# Altium schematic sheet MCU.SchDoc
size 389 x 250 mm; SheetNumber: 1; SheetTotal: 2
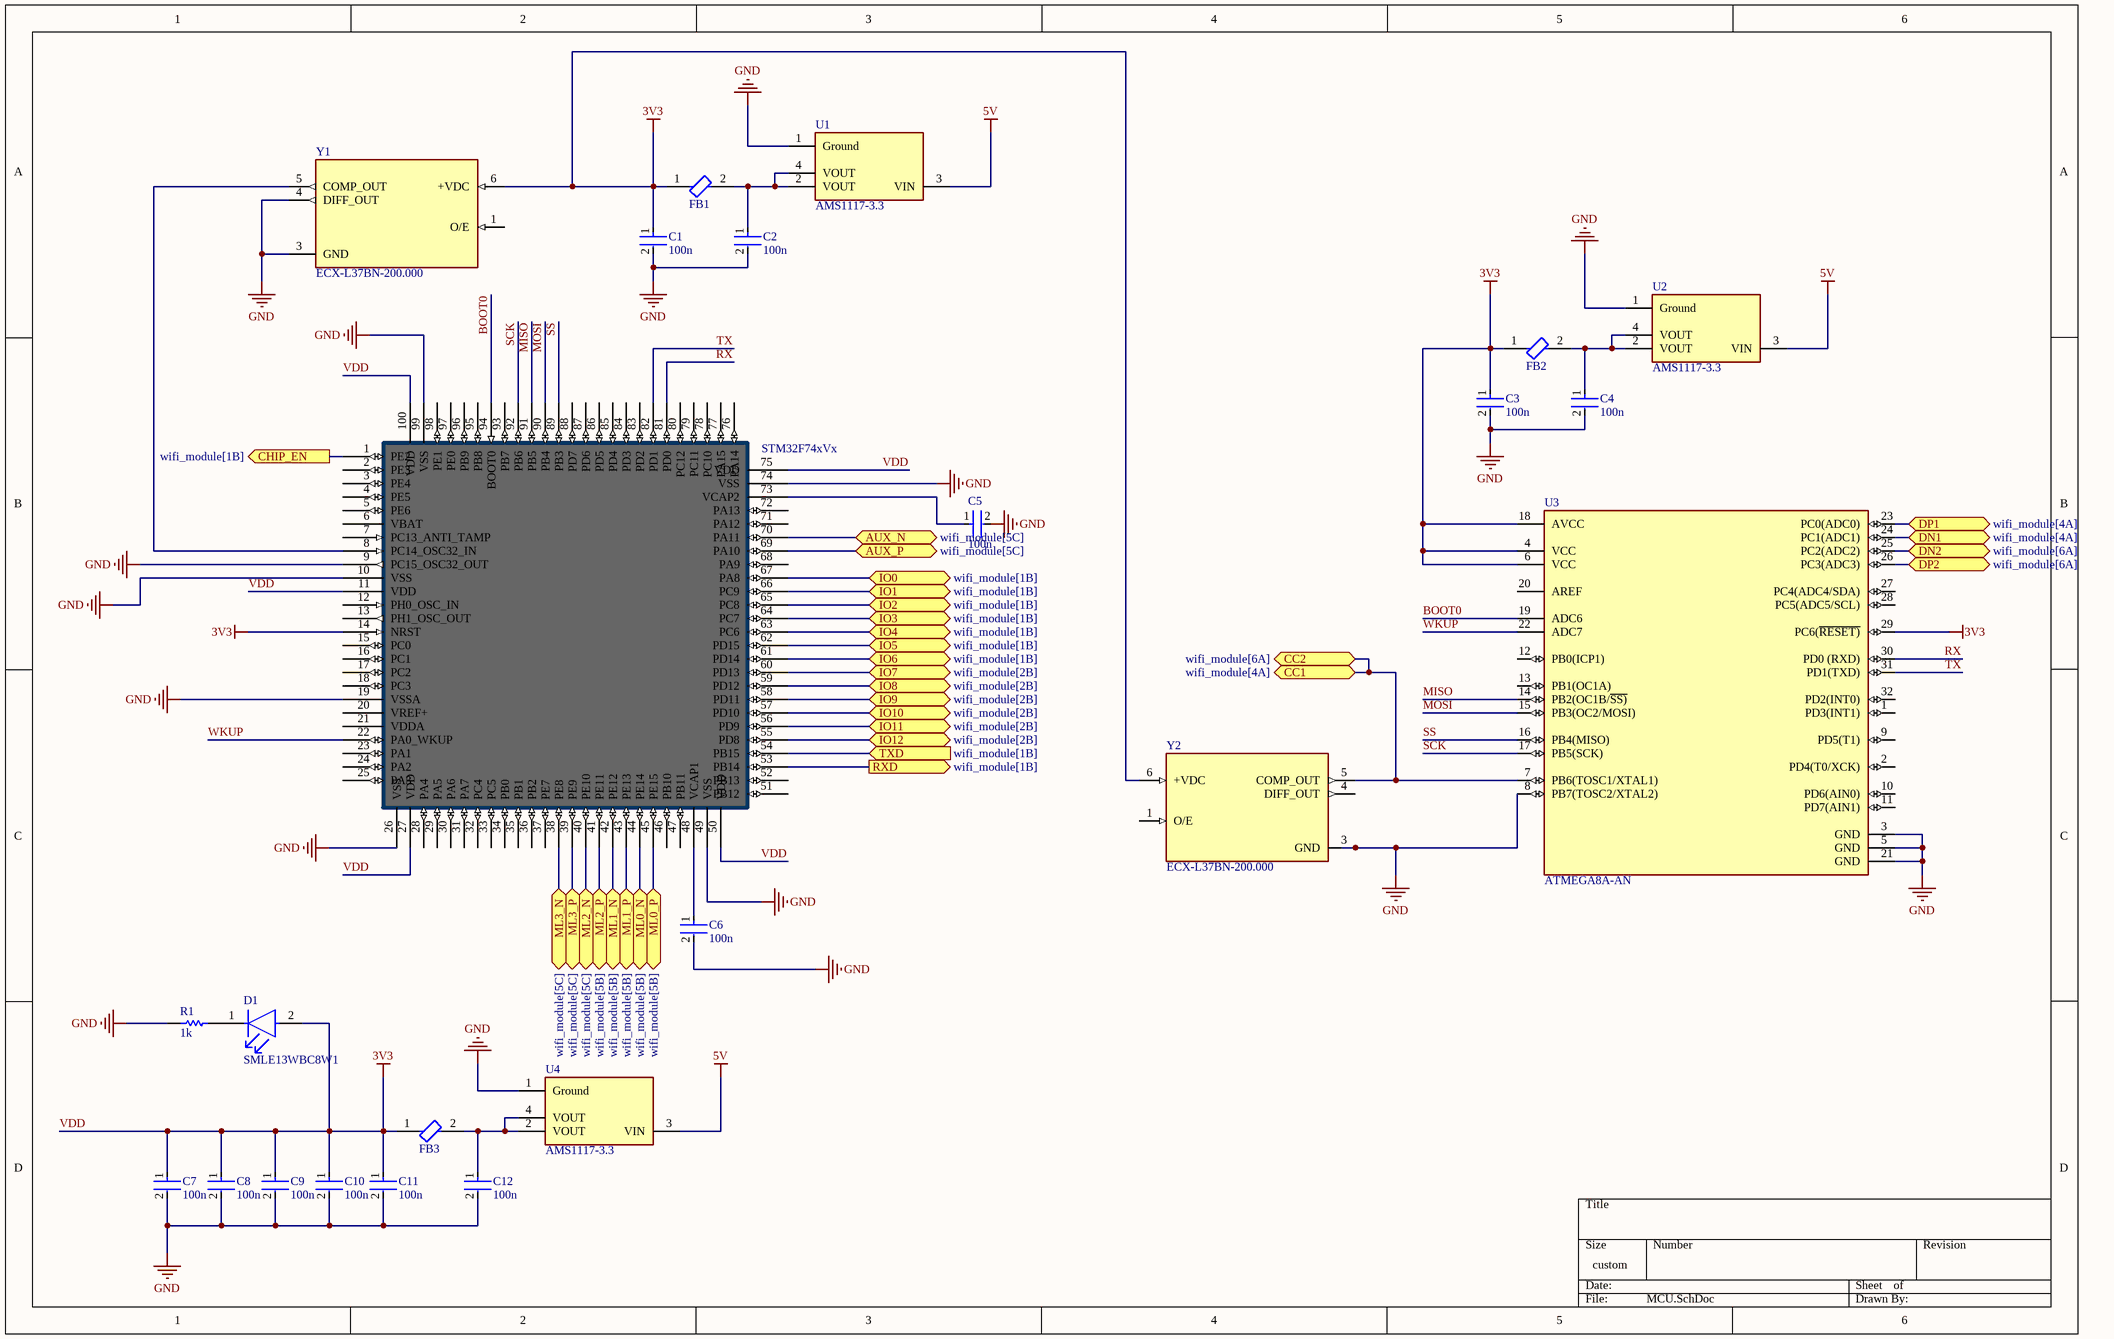
[diagram p0: MCU.SchDoc]

## Parts
C1  100n  [FP-CL10-IPC_C]
C2  100n  [FP-CL10-IPC_C]
C3  100n  [FP-CL10-IPC_C]
C4  100n  [FP-CL10-IPC_C]
C5  100n  [FP-CL10-IPC_C]
C6  100n  [FP-CL10-IPC_C]
C7  100n  [FP-CL10-IPC_C]
C8  100n  [FP-CL10-IPC_C]
C9  100n  [FP-CL10-IPC_C]
C10  100n  [FP-CL10-IPC_C]
C11  100n  [FP-CL10-IPC_C]
C12  100n  [FP-CL10-IPC_C]
D1  SMLE13WBC8W1  [FP-SMLE13WBC8W1-MFG]
FB1  BLM18KG121TN1D  [FP-BLM18-0_15-t0_6-d1_2-IPC_A]  (value not drawn)
FB2  BLM18KG121TN1D  [FP-BLM18-0_15-t0_6-d1_2-IPC_A]  (value not drawn)
FB3  BLM18KG121TN1D  [FP-BLM18-0_15-t0_6-d1_2-IPC_A]  (value not drawn)
R1  1k  [RESC2013X60X35ML10T20]
U0  STM32F74xVx  [CQFP-STM32F74xVx]
U1  AMS1117-3.3  [FP-AMS1117-IPC_C]
U2  AMS1117-3.3  [FP-AMS1117-IPC_C]
U3  ATMEGA8A-AN  [FP-C04-074-PT-MFG]
U4  AMS1117-3.3  [FP-AMS1117-IPC_C]
Y1  ECX-L37BN-200.000  [OSC_ECX-L37BN-200.000]
Y2  ECX-L37BN-200.000  [OSC_ECX-L37BN-200.000]

## Ports
AUX_N (bidir, see wifi_module[5C]), AUX_P (bidir, see wifi_module[5C]), CC1 (bidir, see wifi_module[4A]), CC2 (bidir, see wifi_module[6A]), CHIP_EN (out, see wifi_module[1B]), DN1 (bidir, see wifi_module[4A]), DN2 (bidir, see wifi_module[6A]), DP1 (bidir, see wifi_module[4A]), DP2 (bidir, see wifi_module[6A]), IO0 (bidir, see wifi_module[1B]), IO1 (bidir, see wifi_module[1B]), IO2 (bidir, see wifi_module[1B]), IO3 (bidir, see wifi_module[1B]), IO4 (bidir, see wifi_module[1B]), IO5 (bidir, see wifi_module[1B]), IO6 (bidir, see wifi_module[1B]), IO7 (bidir, see wifi_module[2B]), IO8 (bidir, see wifi_module[2B]), IO9 (bidir, see wifi_module[2B]), IO10 (bidir, see wifi_module[2B]), IO11 (bidir, see wifi_module[2B]), IO12 (bidir, see wifi_module[2B]), ML0_N (bidir, see wifi_module[5B]), ML0_P (bidir, see wifi_module[5B]), ML1_N (bidir, see wifi_module[5B]), ML1_P (bidir, see wifi_module[5B]), ML2_N (bidir, see wifi_module[5C]), ML2_P (bidir, see wifi_module[5B]), ML3_N (bidir, see wifi_module[5C]), ML3_P (bidir, see wifi_module[5C]), RXD (out, see wifi_module[1B]), TXD (in, see wifi_module[1B])

## Nets
5V: U1.3(VIN) U2.3(VIN) U4.3(VIN)
GND: C1.2 C2.2 C3.2 C4.2 C5.2 C6.2 C7.2 C8.2 C9.2 C10.2 C11.2 C12.2 R1.1 U0.9(PC15_OSC32_OUT) U0.10(VSS) U0.19(VSSA) U0.26(VSS) U0.49(VSS) U0.74(VSS) U0.99(VSS) U1.1(Ground) U2.1(Ground) U3.3(GND) U3.5(GND) U3.8(PB7(TOSC2/XTAL2)) U3.21(GND) U4.1(Ground) Y1.3(GND) Y1.4(DIFF_OUT) Y2.3(GND)
VDD: C1.1 C3.1 C7.1 C8.1 C9.1 C10.1 C11.1 D1.2(A) FB1.1 FB2.1 FB3.1 U0.11(VDD) U0.14(NRST) U0.27(VDD) U0.50(VDD) U0.75(VDD) U0.100(VDD) U3.4(VCC) U3.6(VCC) U3.18(AVCC) U3.29(PC6(~{RESET)}) Y1.6(+VDC) Y2.6(+VDC)  [also labelled 3V3]
AUX_N: U0.70(PA11) ; port AUX_N
AUX_P: U0.69(PA10) ; port AUX_P
BOOT0: U0.94(BOOT0) U3.19(ADC6)
CC1: U3.7(PB6(TOSC1/XTAL1)) Y2.5(COMP_OUT) ; port CC2, port CC1
CHIP_EN: U0.1(PE2) ; port CHIP_EN
DN1: U3.24(PC1(ADC1)) ; port DN1
DN2: U3.25(PC2(ADC2)) ; port DN2
DP1: U3.23(PC0(ADC0)) ; port DP1
DP2: U3.26(PC3(ADC3)) ; port DP2
IO0: U0.67(PA8) ; port IO0
IO1: U0.66(PC9) ; port IO1
IO2: U0.65(PC8) ; port IO2
IO3: U0.64(PC7) ; port IO3
IO4: U0.63(PC6) ; port IO4
IO5: U0.62(PD15) ; port IO5
IO6: U0.61(PD14) ; port IO6
IO7: U0.60(PD13) ; port IO7
IO8: U0.59(PD12) ; port IO8
IO9: U0.58(PD11) ; port IO9
IO10: U0.57(PD10) ; port IO10
IO11: U0.56(PD9) ; port IO11
IO12: U0.55(PD8) ; port IO12
MISO: U0.91(PB5) U3.14(PB2(OC1B/~{SS)})
ML0_N: U0.44(PE14) ; port ML0_N
ML0_P: U0.45(PE15) ; port ML0_P
ML1_N: U0.42(PE12) ; port ML1_N
ML1_P: U0.43(PE13) ; port ML1_P
ML2_N: U0.40(PE10) ; port ML2_N
ML2_P: U0.41(PE11) ; port ML2_P
ML3_N: U0.38(PE8) ; port ML3_N
ML3_P: U0.39(PE9) ; port ML3_P
MOSI: U0.90(PB4) U3.15(PB3(OC2/MOSI))
RX: U0.81(PD0) U3.30(PD0_(RXD))
RXD: U0.53(PB14) ; port RXD
SCK: U0.92(PB6) U3.17(PB5(SCK))
SS: U0.89(PB3) U3.16(PB4(MISO))
TX: U0.82(PD1) U3.31(PD1(TXD))
TXD: U0.54(PB15) ; port TXD
WKUP: U0.22(PA0_WKUP) U3.22(ADC7)
NetC2_1: C2.1 FB1.2 U1.2(VOUT) U1.4(VOUT)
NetC4_1: C4.1 FB2.2 U2.2(VOUT) U2.4(VOUT)
NetC5_1: C5.1 U0.73(VCAP2)
NetC6_1: C6.1 U0.48(VCAP1)
NetC12_1: C12.1 FB3.2 U4.2(VOUT) U4.4(VOUT)
NetD1_1: D1.1(C) R1.2
NetU0_8: U0.8(PC14_OSC32_IN) Y1.5(COMP_OUT)

Not connected (* = marked no-connect by the designer): U0 2(PE3) 3(PE4) 4(PE5) 5(PE6) 6(VBAT) 7(PC13_ANTI_TAMP) 12(PH0_OSC_IN) 13(PH1_OSC_OUT) 15(PC0) 16(PC1) 17(PC2) 18(PC3) 20(VREF+) 21(VDDA) 23(PA1) 24(PA2) 25(PA3) 28(PA4) 29(PA5) 30(PA6) 31(PA7) 32(PC4) 33(PC5) 34(PB0) 35(PB1) 36(PB2) 37(PE7) 46(PB10) 47(PB11) 51(PB12) 52(PB13) 68(PA9) 71(PA12) 72(PA13) 76(PA14) 77(PA15) 78(PC10) 79(PC11) 80(PC12) 83(PD2) 84(PD3) 85(PD4) 86(PD5) 87(PD6) 88(PD7) 93(PB7) 95(PB8) 96(PB9) 97(PE0) 98(PE1); U3 1(PD3(INT1)) 2(PD4(T0/XCK)) 9(PD5(T1)) 10(PD6(AIN0)) 11(PD7(AIN1)) 12(PB0(ICP1)) 13(PB1(OC1A)) 20(AREF) 27(PC4(ADC4/SDA)) 28(PC5(ADC5/SCL)) 32(PD2(INT0)); Y1 1(O/E); Y2 1(O/E) 4(DIFF_OUT)

## Library data of the parts
C1-C12 = CMP-13271-003017-1: Cap Ceramic 4.7uF 10V X5R ±10% Pad SMD 0603 +85°C T/R; Capacitance: 4.7uF; Case/Package: 0603; Packaging: Tape and Reel; Width: 0.031inch; Contact Plating: Tin; Thickness: 0.035inch; Package Quantity: 1; Voltage Rating: 10V; Case Code (Metric): 1608; Case Code (Imperial): 0603; Depth: 0.8mm; Height: 0.8mm; Tolerance: 10%; Max Operating Temperature: 85°C; Length: 1.6mm; Dielectric: X5R; Mount: Surface Mount; Radiation Hardening: No; Min Operating Temperature: -55°C
D1 = CMP-08952-000004-1: LED WHITE 0603 SMD; Manufacturer: Rohm; Luminous Intensity: 140mcd; Led Orientation: Top View; Reverse Voltage: 5V; Forward Voltage: 2.9V; Forward Current: 5mA; Power Dissipation: 66mW; Temperature Range Low: -40°C; Digikey Description: LED WHITE 0603 SMD; Temperature Range High: +85°C; Temperature: -40°C to +85°C; Manufacturer Part Number: SMLE13WBC8W1; Colour: White; Mouser Description: Standard LEDs - SMD ExceLED White LED 120mcd 5mA; Octopart: https://octopart.com/smle13wbc8w1-rohm-22224565; Automotive: No; Device Class L2: LEDs; Lead Free: Yes; ComponentLink2URL: https://media.digikey.com/pdf/Data%20Sheets/Rohm%20PDFs/SMLE13WBC8W1_Spec.pdf; Device Class L3: unset; Package: 0; RoHS: TRUE; Height: 0.4mm; Category: Diode; Device Class L1: Optoelectronics; ComponentLink2Description: Datasheet
FB1-FB3 = CMP-0686-00554-8: FERRITE BEAD 120 OHM 0603 1LN; Max Current Rating: 3A; DC Resistance (DCR): 30mR; Impedance: 120R; Number of Lines: 1; Test Frequency: 100MHz; Tolerance: 25%; Package Quantity: 4000; Min Operating Temperature: -55°C; Termination: SMD/SMT; REACH SVHC: No SVHC; Core Material: Ferrite; Material: Ferrite; Current Rating: 3A; Height: 0.8mm; Number of Pins: 2; Case/Package: 0603; Case Code (Imperial): 0603; Series: BLM18K; Packaging: Tape and Reel; Inductor Type: FERRITE BEAD; Lead Free: Lead Free; Width: 0.8mm; Case Code (Metric): 1608; Number of Circuits: 1; Max DC Current: 3A; Depth: 0.95mm; Max Operating Temperature: 125°C; Length: 1.6mm; RoHS Compliant: Yes
R1 = CMP-2100-03673-1: Chip Resistor, 0 Ohm, Jumper, +/- 5%, 0.125 W, -55 to 155 degC, 0805 (2012 Metric), RoHS, Tape and Reel; Manufacturer: Yageo; Power Rating: 125mW; Resistance: 0mOhm; Voltage Rating (DC): 150V; Temperature Coefficient: 200ppm/degreesC; Height: 0.5mm; Depth: 1.25mm; Case Code (Imperial): 0805; Lead Free: LeadFree; Military Standard: Not; Package Description: 2-Pin Surface Mounted Device, Body 2 x 1.25 mm; Case Code (Metric): 2012; Composition: ThickFilm; Voltage Rating: 150V; Manufacturer URL: http://www.yageo.com/; Packaging: TapeandReel; Package Reference: 0805; REACH SVHC: Unknown; Tolerance: 5%; Case/Package: 0805; Max Operating Temperature: 155degC; Number of Pins: 2; Min Operating Temperature: -55degC; RoHSCompliant: true; Length: 2mm; Datasheet URL: http://www.yageo.com/NewPortal/yageodocoutput?fileName=/pdf/R-Chip/PYu-RC_Group_51_RoHS_L_5.pdf; Termination: SMD/SMT; Radiation Hardening: No; Width: 1.25mm; Contact Plating: Tin; Datasheet Version: Rev. 5, 10/2016
U0 = STM32F74xVx: STM32F74xVx LQFP100 pinout
U1 U2 U4 = CMP-209535-000001-1: LDO Voltage Regulators 1A, 3.3V; Manufacturer: Advanced Monolithic Systems; Dropout Voltage: 1.1V; Output Type: Fixed; Nominal Supply Current: 5mA; Max Power Dissipation: 1.2W; Max Supply Voltage: 15V; Number Of Outputs: 1; Standoff Height: 0.64mm; Max Junction Temp: +125°C; Height: 1.8mm; Package: AMS1117; Device Class L2: Power Management ICs; ComponentLink2Description: Datasheet; ComponentLink2URL: http://www.advanced-monolithic.com/pdf/ds1117.pdf; Category: IC; RoHS: TRUE; Automotive: No; Device Class L1: Integrated Circuits (ICs); Output Current: 1A; Device Class L3: Voltage Regulators - Linear; Temperature: -40°C to +125°C; Output Voltage: 3.3V; Manufacturer Part Number: AMS1117-3.3; Temperature Range Low: -40°C; Octopart: https://octopart.com/ams1117-3.3-advanced+monolithic+systems-25899300; Lead Free: Yes; Ipc Land Pattern Name: SOT229P700X180-4; Temperature Range High: +125°C
U3 = CMP-00252-77760635-1: ATMEGA8A-AN RISC Microcontroller, 8-Bit, FLASH, 16MHz, CMOS, PQFP32; Oscillator Type: Internal; Interface: I2C, SPI, UART, USART; Max Supply Voltage: 5.5V; Memory Size: 8kB; Core Architecture: AVR; Number of Timers/Counters: 3; Min Supply Voltage: 2.7V; Number of I/Os: 23; Peripherals: Brown-out Detect/Reset, POR, PWM, WDT; Data Bus Width: 8b; RAM Size: 1kB; Max Operating Temperature: 105°C; Frequency: 16MHz; RoHS: Compliant; Memory Type: FLASH; Min Operating Temperature: -40°C; Max Frequency: 16MHz; Lifecycle Status: Production; NexarPartId: 77760635; Case/Package: TQFP; Number of Pins: 32
Y1 Y2 = ECX-L37BN-200.000: 200 MHz XO (Standard) LVDS Oscillator 3.3V Enable/Disable 6-SMD, No Lead; MF: ECS Inc.; MP: ECX-L37BN-200.000; Package: SMD-6 ECS International; Purchase-URL: https://pricing.snapeda.com/search/part/ECX-L37BN-200.000/?ref=eda; Price: None; Value: *; SnapEDA_Link: https://www.snapeda.com/parts/ECX-L37BN-200.000/ECS+Inc./view-part/?ref=snap; Check_prices: https://www.snapeda.com/parts/ECX-L37BN-200.000/ECS+Inc./view-part/?ref=eda; Availability: In Stock